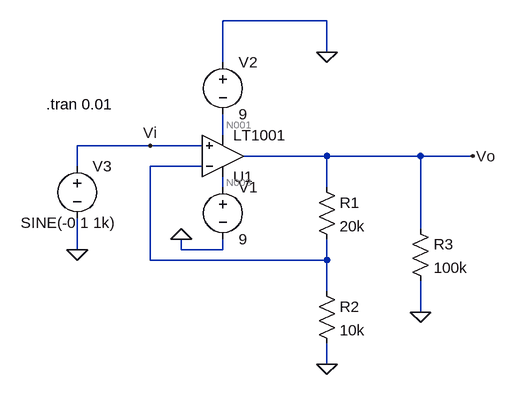
[diagram p0: schematic Op-Amp feedback (VCVS).asc]
Op-Amp feedback (VCVS).asc, the LTspice schematic file:
Version 4
SHEET 1 880 680
WIRE 416 -16 256 -16
WIRE 416 32 416 -16
WIRE 256 48 256 -16
WIRE 256 160 256 128
WIRE 144 176 32 176
WIRE 224 176 144 176
WIRE 416 192 288 192
WIRE 560 192 416 192
WIRE 640 192 560 192
WIRE 32 208 32 176
WIRE 224 208 144 208
WIRE 256 240 256 224
WIRE 416 240 416 192
WIRE 560 304 560 192
WIRE 32 336 32 288
WIRE 192 336 192 320
WIRE 256 336 256 320
WIRE 256 336 192 336
WIRE 144 352 144 208
WIRE 416 352 416 320
WIRE 416 352 144 352
WIRE 416 400 416 352
WIRE 560 432 560 384
WIRE 416 512 416 480
FLAG 416 512 0
FLAG 560 432 0
FLAG 32 336 0
FLAG 640 192 Vo
FLAG 192 320 0
FLAG 416 32 0
FLAG 144 176 Vi
SYMBOL OpAmps\\LT1001 256 256 M180
SYMATTR InstName U1
SYMBOL res 400 224 R0
SYMATTR InstName R1
SYMATTR Value 20k
SYMBOL res 400 384 R0
SYMATTR InstName R2
SYMATTR Value 10k
SYMBOL res 544 288 R0
SYMATTR InstName R3
SYMATTR Value 100k
SYMBOL voltage 32 192 R0
WINDOW 3 -87 103 Left 2
WINDOW 123 0 0 Left 0
WINDOW 39 0 0 Left 0
SYMATTR Value SINE(-0 1 1k)
SYMATTR InstName V3
SYMBOL voltage 256 224 R0
SYMATTR InstName V1
SYMATTR Value 9
SYMBOL voltage 256 32 R0
SYMATTR InstName V2
SYMATTR Value 9
TEXT -16 112 Left 2 !.tran 0.01

The netlist it stands for:
* Op-Amp feedback (VCVS).asc
XU1 Vi N002 N003 N001 Vo LT1001  ; pins In+ In- V+ V- OUT
R1 Vo N002 20k
R2 N002 0 10k
R3 Vo 0 100k
V3 Vi 0 SINE(-0 1 1k)
V1 N003 0 9
V2 0 N001 9
.tran 0.01
.lib LTC.lib
.backanno
.end

* Results of the author's LTspice run, read from the files saved beside the schematic
* Operating Point, zero values left out:
*   V(n003) = 9 V
*   V(n001) = -9 V
*   I(V2) = -2.25 mA
*   I(V1) = -2.25 mA
*   Ix(u1:3) = 2.25 mA
*   Ix(u1:4) = -2.25 mA
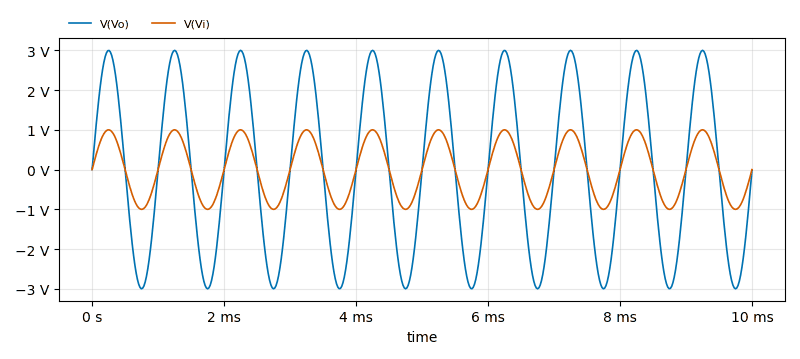
[diagram p1: Transient Analysis of Op-Amp feedback (VCVS).asc, plotted from the saved traces]
* Transient Analysis, 1 run:
*   V(Vo): min -2.997 V, max 2.997 V, average 641 nV, rms 2.119 V, last -10.47 mV
*   V(Vi): min -1 V, max 1 V, average 0 V, rms 707.2 mV, last 0 V